# EAGLE design hello44Leo (EAGLE 6.5.0)
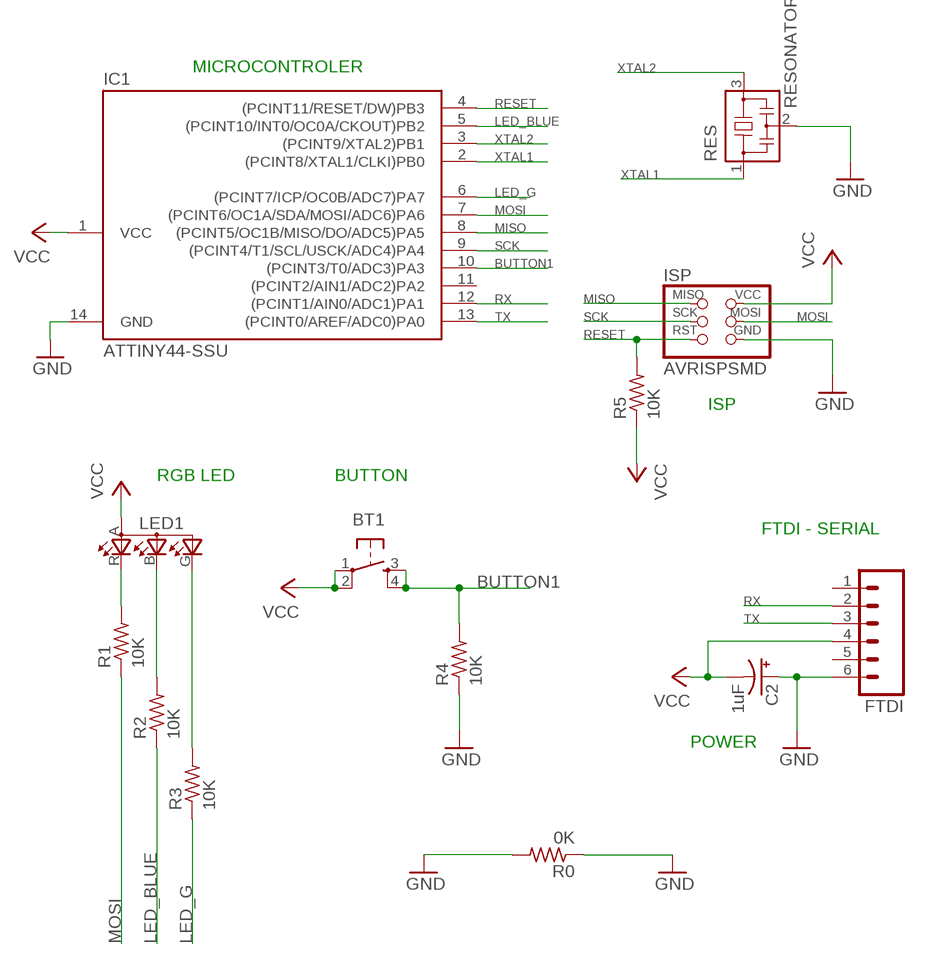
[diagram p0: schematic, sheet 1]

## Parts
BT1  6MM_SWITCH6MM_SWITCH  [6MM_SWITCH]
C2  1uF  POLARIZED_CAPACITORA3216-18  [A3216-18]
FTDI  M061X06-SMD_EDGE_FEMALE  [1X06-SMD_EDGE]
IC1  ATTINY44-SSU  [SOIC14]
ISP  AVRISPSMD  [2X03SMD]
LED1  LEDRGBOLD  [P-LCC-4-3]
R0  0K  RESISTOR1206  [1206]
R1  10K  RESISTOR1206  [1206]
R2  10K  RESISTOR1206  [1206]
R3  10K  RESISTOR1206  [1206]
R4  10K  RESISTOR1206  [1206]
R5  10K  RESISTOR1206  [1206]
RES  RESONATOR  [EFOBM]

## Nets
BUTTON1: BT1.3(S) BT1.4(S1) IC1.10((PCINT3/T0/ADC3)PA3) R4.2
GND: C2.+ FTDI.6 IC1.14(GND) ISP.6(GND) R0.1 R0.2 R4.1 RES.2
LED_BLUE: IC1.5((PCINT10/INT0/OC0A/CKOUT)PB2) R2.1
LED_G: IC1.6((PCINT7/ICP/OC0B/ADC7)PA7) R3.1
MISO: IC1.8((PCINT5/OC1B/MISO/DO/ADC5)PA5) ISP.1(MISO)
MOSI: IC1.7((PCINT6/OC1A/SDA/MOSI/ADC6)PA6) ISP.4(MOSI) R1.1
N$1: LED1.R(CRED) R1.2
N$2: LED1.B(CBLUE) R2.2
N$3: LED1.G(CGREEN) R3.2
RESET: IC1.4((PCINT11/RESET/DW)PB3) ISP.5(RST) R5.2
RX: FTDI.2 IC1.12((PCINT1/AIN0/ADC1)PA1)
SCK: IC1.9((PCINT4/T1/SCL/USCK/ADC4)PA4) ISP.3(SCK)
TX: FTDI.3 IC1.13((PCINT0/AREF/ADC0)PA0)
VCC: BT1.1(P) BT1.2(P1) C2.- FTDI.4 IC1.1(VCC) ISP.2(VCC) LED1.A(A2) R5.1
XTAL1: IC1.2((PCINT8/XTAL1/CLKI)PB0) RES.1
XTAL2: IC1.3((PCINT9/XTAL2)PB1) RES.3
Unconnected: FTDI.1 FTDI.5 IC1.11((PCINT2/AIN1/ADC2)PA2)

## Notes on the sheet
- MICROCONTROLER
- ISP
- RGB LED | BUTTON
- FTDI - SERIAL
- POWER

## Library data of the parts
BT1 = 01_FAB_Hello:6MM_SWITCH: OMRON SWITCH
C2 = 01_ng:POLARIZED_CAPACITOR: polarized capacitor
FTDI = 01_SparkFun:M06: Header 6 Standard 6-pin 0.1" header. Use with straight break away headers (SKU : PRT-00116), right angle break away headers (PRT-00553), swiss pins (PRT-00743), machine pins (PRT-00117), and female headers (PRT-00115). Molex polarized connector foot print use with SKU : PRT-08094 with associated crimp pins and housings. NOTES ON THE VARIANTS LOCK and LOCK_LONGPADS... This footprint was designed to help hold the alignment of a through-hole component (i.e. 6-pin header) while soldering it into place. You may notice that each hole has been shifted either up or down by 0.005 of an inch from it's more standard position (which is a perfectly straight line). This slight alteration caused the pins (the squares in the middle) to touch the edges of the holes. Because they are alternating, it causes a "brace" to hold the component in place. 0.005 has proven to be the perfect amount of "off-center" position when using our standard breakaway headers. Although looks a little odd when you look at the bare footprint, once you have a header in there, the alteration is very hard to notice. Also, if you push a header all the way into place, it is covered up entirely on the bottom side. This idea of altering the position of holes to aid alignment will be further integrated into the Sparkfun Library for other footprints. It can help hold any component with 3 or more connection pins.
IC1 = 01_fab:ATTINY44
ISP = 01_fab:AVRISP
LED1 = 01_fab:LEDRGBOLD: OSRAM Hyper Multi TOPLED® Hyper-Bright LED LATB T686 Source: http://www.osram.convergy.de/
R0 R1-R5 = 01_FAB_Hello:RESISTOR
RES = 01_fab:RESONATOR

## Board
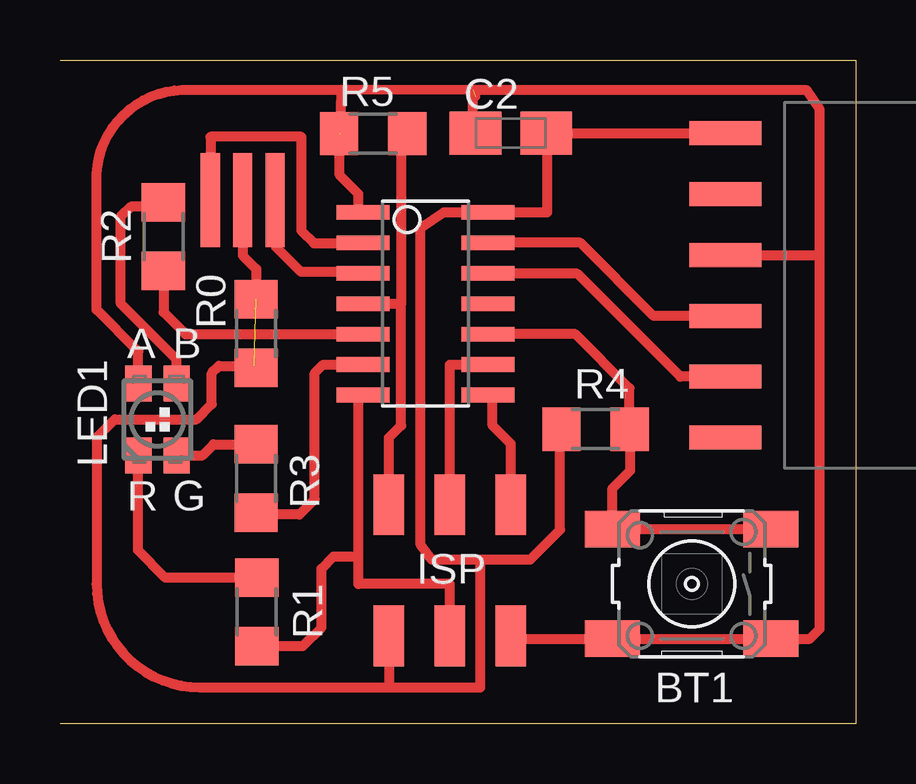
[diagram p1: board, top side]

Size 33.17 x 27.69 mm. Coordinates in mm from the lower left corner, seen from the top.
Outline: 0,27.69 33.17,27.69 33.17,0 0,0
Copper layers (1*16): Top 0.035mm / dielectric 1.5mm / Bottom 0.035mm
Design rules "default": minimum track width 10mil, minimum drill 24mil, track to track 8mil, track to pad 8mil, pad to pad 8mil, via to via 8mil, smd to smd 8mil, copper to edge 40mil, drill to drill 8mil, minimum pad ring 10mil, minimum via ring 8mil, stop-mask expansion 4mil, vias tented up to drill 0mil, thermal gap 10mil

### Footprints (pad centres in the part's own frame; a part is rotated, then mirrored left to right if it is on the bottom)
6MM_SWITCH = smd 2.286 x 1.524: 1 -3.302,2.286; 2 3.302,2.286; 3 -3.302,-2.286; 4 3.302,-2.286
A3216-18 = smd 2.15 x 1.8: + 1.475,0; - -1.475,0
1X06-SMD_EDGE = smd 1 x 3: 1 0,-0.08; 2 2.54,-0.08; 3 5.08,-0.08; 4 7.62,-0.08; 5 10.16,-0.08; 6 12.7,-0.08
SOIC14 = smd 0.61 x 2.21: 1 -3.81,-2.603; 2 -2.54,-2.603; 3 -1.27,-2.603; 4 0,-2.603; 5 1.27,-2.603; 6 2.54,-2.603; 7 3.81,-2.603; 8 3.81,2.603; 9 2.54,2.603; 10 1.27,2.603; 11 0,2.603; 12 -1.27,2.603; 13 -2.54,2.603; 14 -3.81,2.603
2X03SMD = smd 2.54 x 1.27: 1 -2.54,2.54; 2 2.92,2.54; 3 -2.54,0; 4 2.92,0; 5 -2.54,-2.54; 6 2.92,-2.54
P-LCC-4-3 = smd 1.1 x 1.5: A -0.8,1.5; B 0.8,1.5; G 0.8,-1.5; R -0.8,-1.5
1206 = smd 1.6 x 1.803: 1 -1.422,0; 2 1.422,0
EFOBM = smd 0.8 x 3.9: 1 -1.35,0; 2 0,0; 3 1.35,0

### Placement (x,y rotation side)
BT1  26.34,5.84 180 top
C2  18.8,24.64 0 top
FTDI  27.66,11.94 90 top
IC1  15.24,17.53 270 top
ISP  16.26,6.6 270 top
LED1  4.06,12.7 0 top
R0  8.18,16.28 90 top
R1  8.2,4.67 90 top
R2  4.32,20.32 90 top
R3  8.18,10.24 90 top
R4  22.33,12.29 0 top
R5  13.06,24.61 0 top
RES  7.62,21.84 0 top

### Tracks (layer width: path | path; a pad name or v marks a point on that pad's centre or on a via)
BUTTON1
  Top 0.406: BT1.3 BT1.4 23.04,9.83 23.77,10.57 23.77,12.27 R4.2 23.75,14 21.49,16.26 IC1.10
GND  (1 unrouted)
  Top 0.406: ISP.6 13.72,1.52 | 13.72,1.52 17.53,1.52 17.53,6.86 | 20.32,24.64 20.32,21.34 IC1.14 16,21.34 15.04,20.68 15.04,7.47 15.49,6.86 17.53,6.86 | 20.32,24.64 C2.+ | 17.53,6.86 19.61,6.86 20.85,8.1 20.85,12.24 R4.1 | 13.72,1.52 5.84,1.52 arc-90 1.52,5.84 1.52,11.94 2.29,12.7 5.69,12.7 6.33,13.34 6.33,14.63 6.63,14.94 8.1,14.94 R0.1 | RES.2 7.62,19.53 8.18,18.97 R0.2 | 20.32,24.64 FTDI.6
LED_BLUE
  Top 0.406: R2.1 4.32,17.17 5.23,16.26 IC1.5
LED_G
  Top 0.406: IC1.6 10.97,14.99 10.62,14.63 10.62,9.37 9.98,8.74 8.25,8.74 R3.1
MISO
  Top 0.406: ISP.1 18.8,11.68 18.03,12.45 18.03,13.53 IC1.8
MOSI
  Top 0.406: 11.94,13.72 IC1.7 12.45,13.53 12.45,6.98 | ISP.4 16.26,5.84 12.45,5.84 12.45,6.98 | R1.1 10.14,3.25 10.9,4.01 10.9,6.48 11.41,6.98 12.45,6.98
N$1
  Top 0.406: R1.2 4.39,6.1 3.25,7.24 3.25,11.19 LED1.R
N$2
  Top 0.406: 4.22,21.84 R2.2 4.17,21.59 3,21.59 2.54,21.16 2.54,17.53 4.86,15.2 LED1.B
N$3
  Top 0.406: LED1.G 5.94,11.2 6.4,11.66 R3.2
RESET
  Top 0.406: 14.22,17.53 14.22,24.64 R5.2 | IC1.4 14.22,17.53 | ISP.5 13.72,11.94 14.22,12.45 14.22,17.53
RX
  Top 0.406: FTDI.2 25.86,14.48 21.56,18.77 17.87,18.77 IC1.12
SCK
  Top 0.406: ISP.3 16.26,14.99 IC1.9
TX
  Top 0.406: FTDI.3 24.74,17.02 21.69,20.07 IC1.13
VCC  (2 unrouted)
  Top 0.406: C2.- 17.27,24.64 17.2,24.71 17.22,26.42 | 17.32,26.16 17.27,26.16 | 11.71,26.44 11.68,24.64 | ISP.2 18.92,3.68 19.05,3.56 BT1.2 BT1.1 31.27,3.56 31.67,3.96 31.67,19.58 | LED1.A 3.26,15.53 1.52,17.27 1.52,22.61 arc-90 5.1,26.44 11.71,26.44 | IC1.1 12.45,21.53 12.45,22.1 11.66,22.88 R5.1 | 31.67,19.58 31.67,25.63 31.14,26.42 17.22,26.42 | 17.22,26.42 11.71,26.44 | FTDI.4 31.65,19.56 31.67,19.58
XTAL1
  Top 0.406: RES.1 6.27,22.02 6.27,24.49 10.06,24.49 10.06,20.57 10.59,20.04 12.61,20.04 IC1.2
XTAL2
  Top 0.406: IC1.3 arc-90 12.61,18.77 12.54,18.85 10.06,18.85 8.97,19.93 8.97,20.63 | 8.94,20.6 8.97,20.63 | 8.97,20.63 RES.3